# Altium schematic sheet 00_Principal.SchDoc
size A3; SheetNumber: 1; SheetTotal: 11
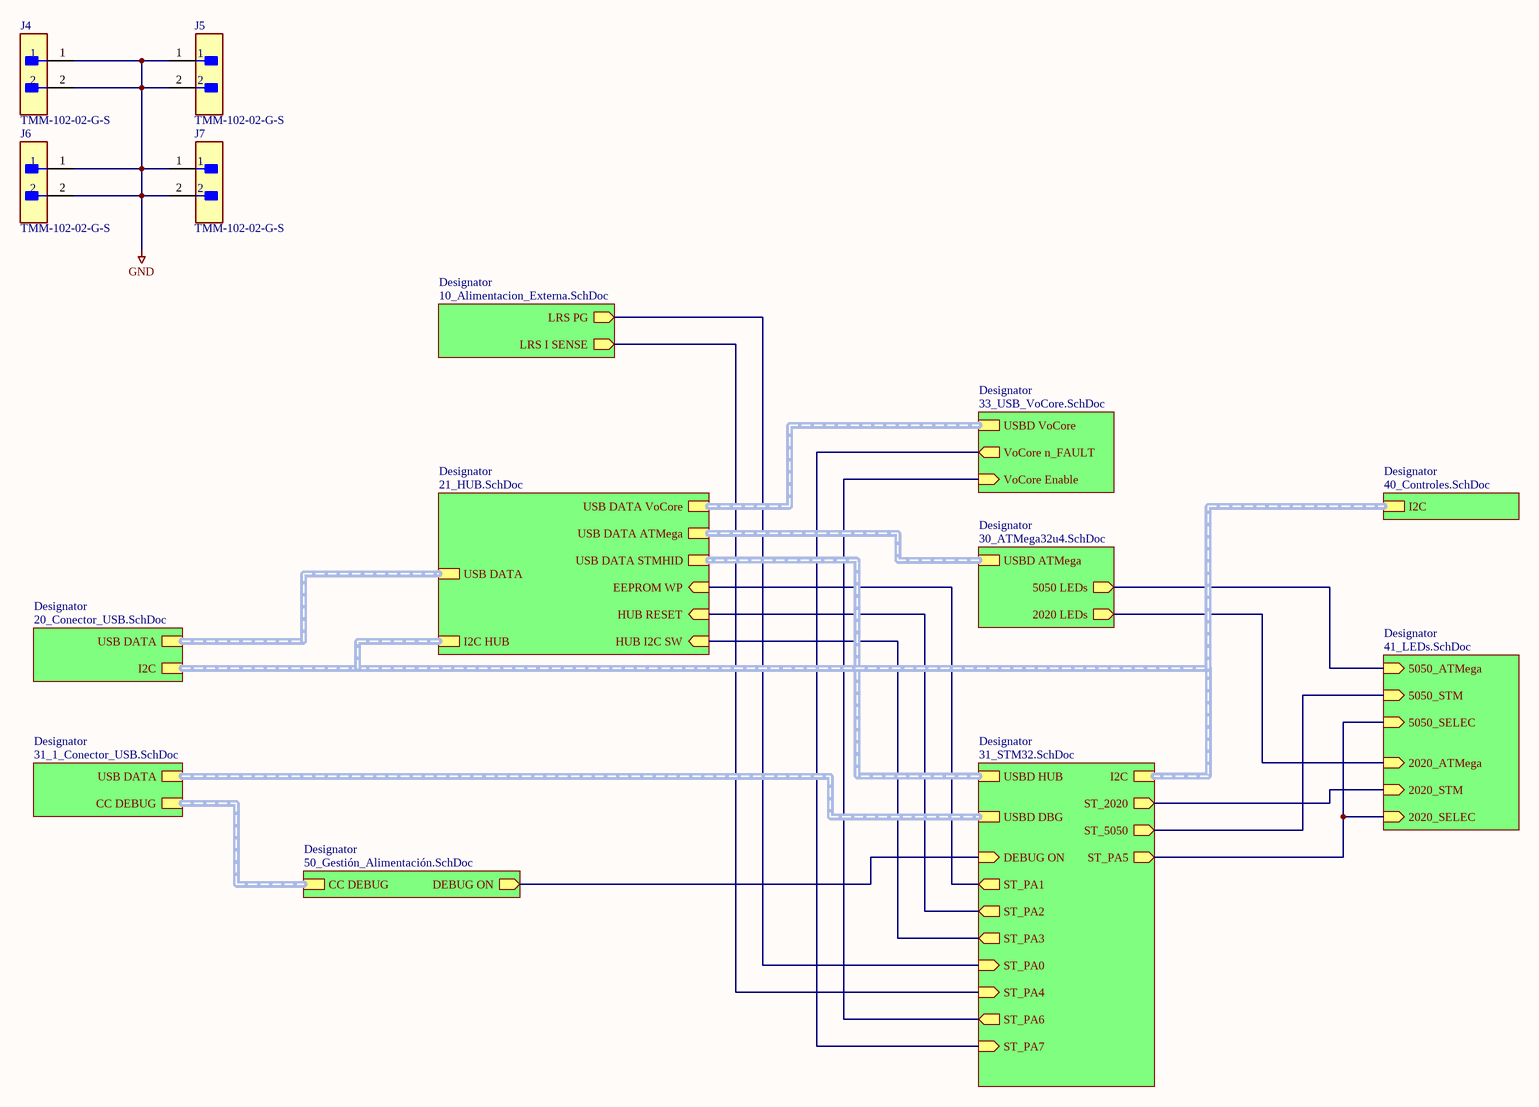
[diagram p0: 00_Principal.SchDoc]

## Parts
J4  TMM-102-02-G-S  [FP-TMM-102-02-G-S-MFG]
J5  TMM-102-02-G-S  [FP-TMM-102-02-G-S-MFG]
J6  TMM-102-02-G-S  [FP-TMM-102-02-G-S-MFG]
J7  TMM-102-02-G-S  [FP-TMM-102-02-G-S-MFG]

## Sub-sheets
Designator = 10_Alimentacion_Externa.SchDoc: LRS PG (out), LRS I SENSE (out)
Designator = 20_Conector_USB.SchDoc: USB DATA (harness USBD LINK), I2C (harness I2C BUS)
Designator = 21_HUB.SchDoc: HUB RESET (in), USB DATA (harness USBD BUS), USB DATA VoCore (harness USBD BUS), USB DATA ATMega (harness USBD BUS), USB DATA STMHID (harness USBD BUS), EEPROM WP (in), HUB I2C SW (in), I2C HUB (harness I2C BUS)
Designator = 31_1_Conector_USB.SchDoc: USB DATA (harness USBD LINK), CC DEBUG (harness CC BUS)
Designator = 50_Gestión_Alimentación.SchDoc: CC DEBUG (harness CC BUS), DEBUG ON (out)
Designator = 31_STM32.SchDoc: USBD HUB (harness USBD BUS), I2C (harness I2C BUS), ST_2020 (out), ST_5050 (out), ST_PA0 (in), ST_PA1 (out), ST_PA2 (out), ST_PA3 (out), ST_PA4 (in), ST_PA5 (out), DEBUG ON (in), USBD DBG (harness USBD BUS), ST_PA7 (in), ST_PA6 (out)
Designator = 30_ATMega32u4.SchDoc: 5050 LEDs (out), 2020 LEDs (out), USBD ATMega (harness USBD BUS)
Designator = 33_USB_VoCore.SchDoc: USBD VoCore (harness USBD BUS), VoCore n_FAULT (out), VoCore Enable (in)
Designator = 41_LEDs.SchDoc: 5050_ATMega (in), 5050_STM (in), 5050_SELEC (in), 2020_ATMega (in), 2020_STM (in), 2020_SELEC (in)
Designator = 40_Controles.SchDoc: I2C (harness I2C BUS)

## Nets
GND: J4.1 J4.2 J5.1 J5.2 J6.1 J6.2 J7.1 J7.2
(unnamed): sheet Designator/LRS PG, sheet Designator/ST_PA0
(unnamed): sheet Designator/LRS I SENSE, sheet Designator/ST_PA4
(unnamed): sheet Designator/HUB RESET, sheet Designator/ST_PA2
(unnamed): sheet Designator/EEPROM WP, sheet Designator/ST_PA1
(unnamed): sheet Designator/HUB I2C SW, sheet Designator/ST_PA3
(unnamed): sheet Designator/DEBUG ON, sheet Designator/DEBUG ON
(unnamed): sheet Designator/ST_2020, sheet Designator/2020_STM
(unnamed): sheet Designator/ST_5050, sheet Designator/5050_STM
(unnamed): sheet Designator/ST_PA5, sheet Designator/5050_SELEC, sheet Designator/2020_SELEC
(unnamed): sheet Designator/ST_PA7, sheet Designator/VoCore n_FAULT
(unnamed): sheet Designator/ST_PA6, sheet Designator/VoCore Enable
(unnamed): sheet Designator/5050 LEDs, sheet Designator/5050_ATMega
(unnamed): sheet Designator/2020 LEDs, sheet Designator/2020_ATMega

## Buses and harness runs
harness sheet Designator/I2C = sheet Designator/I2C HUB
harness sheet Designator/USB DATA = sheet Designator/USBD DBG
harness sheet Designator/USB DATA ATMega = sheet Designator/USBD ATMega
harness sheet Designator/USB DATA STMHID = sheet Designator/USBD HUB
harness sheet Designator/USB DATA VoCore = sheet Designator/USBD VoCore

## Library data of the parts
J4-J7 = CMP-02766-001563-1: CONN HEADER VERT 2POS 2MM; Gender: Male; Number of Positions: 2; Max Current Rating: 3.9A; Max Voltage Rating (AC): 500V; Fastening Type: Pull; Series: TMM; Orientation: Straight; RoHS Compliant: Yes; Contact Shape: Square; Packaging: Bulk; Max Operating Temperature: 125°C; Pitch: 2mm; Termination: Solder; Insulation Color: Black; Contact Plating: Gold; Radiation Hardening: No; Contact Finish - Mating: GOLD; Insulation Material: Polymer; Number of Contacts: 2; Depth: 1.97mm; Contact Type: Male Pin; Number of Rows: 1; Connector Type: Header; Mount: Through Hole; Min Operating Temperature: -55°C; Housing Material: Polymer; Contact Material: Bronze; Housing Color: Black; Length: 4mm